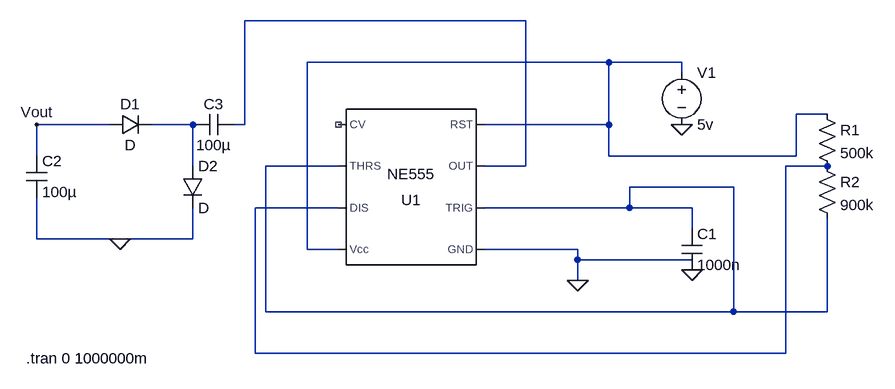
[diagram p0: schematic inverterusing555timeric.asc]
inverterusing555timeric.asc, the LTspice schematic file:
Version 4
SHEET 1 940 2136
WIRE 320 -96 -112 -96
WIRE 448 -32 -16 -32
WIRE 560 -32 448 -32
WIRE 560 -16 560 -32
WIRE 784 48 736 48
WIRE -320 64 -432 64
WIRE -192 64 -256 64
WIRE -112 64 -112 -96
WIRE -112 64 -128 64
WIRE 448 64 448 -32
WIRE 448 64 256 64
WIRE -432 112 -432 64
WIRE 448 112 448 64
WIRE 736 112 736 48
WIRE 736 112 448 112
WIRE -192 128 -192 64
WIRE 32 128 -80 128
WIRE 320 128 320 -96
WIRE 320 128 256 128
WIRE 784 128 720 128
WIRE 640 160 480 160
WIRE 32 192 -96 192
WIRE 480 192 480 160
WIRE 480 192 256 192
WIRE 576 192 480 192
WIRE 576 224 576 192
WIRE -432 240 -432 176
WIRE -304 240 -432 240
WIRE -192 240 -192 192
WIRE -192 240 -304 240
WIRE -16 256 -16 -32
WIRE 32 256 -16 256
WIRE 400 256 256 256
WIRE 400 272 400 256
WIRE 576 272 400 272
WIRE 400 304 400 272
WIRE -80 352 -80 128
WIRE 640 352 640 160
WIRE 640 352 -80 352
WIRE 784 352 784 208
WIRE 784 352 640 352
WIRE -96 416 -96 192
WIRE 720 416 720 128
WIRE 720 416 -96 416
FLAG 400 304 0
FLAG 576 288 0
FLAG 560 64 0
FLAG -304 240 0
FLAG -432 64 Vout
DATAFLAG 784 128 ""
SYMBOL Misc\\NE555 144 160 R180
SYMATTR InstName U1
SYMBOL diode -320 80 R270
WINDOW 0 32 32 VTop 2
WINDOW 3 0 32 VBottom 2
SYMATTR InstName D1
SYMBOL diode -208 128 R0
SYMATTR InstName D2
SYMBOL cap 560 224 R0
SYMATTR InstName C1
SYMATTR Value 1000n
SYMBOL cap -448 112 R0
SYMATTR InstName C2
SYMATTR Value 100µ
SYMBOL cap -128 48 R90
WINDOW 0 0 32 VBottom 2
WINDOW 3 32 32 VTop 2
SYMATTR InstName C3
SYMATTR Value 100µ
SYMBOL voltage 560 -32 R0
WINDOW 123 0 0 Left 0
WINDOW 39 0 0 Left 0
SYMATTR InstName V1
SYMATTR Value 5v
SYMBOL res 768 32 R0
SYMATTR InstName R1
SYMATTR Value 500k
SYMBOL res 768 112 R0
SYMATTR InstName R2
SYMATTR Value 900k
TEXT -448 424 Left 2 !.tran 0 1000000m

The netlist it stands for:
* inverterusing555timeric.asc
XU1 0 N004 N001 N002 NC_01 N004 N005 N002 NE555  ; pins GND TRIG OUT RST CV THRS DIS Vcc
D1 Vout N003 D
D2 N003 0 D
C1 N004 0 1000n
C2 Vout 0 100µ
C3 N001 N003 100µ
V1 N002 0 5v
R1 N002 N005 500k
R2 N005 N004 900k
.model D D
.lib standard.dio
.tran 0 1000000m
.lib NE555.sub
.backanno
.end